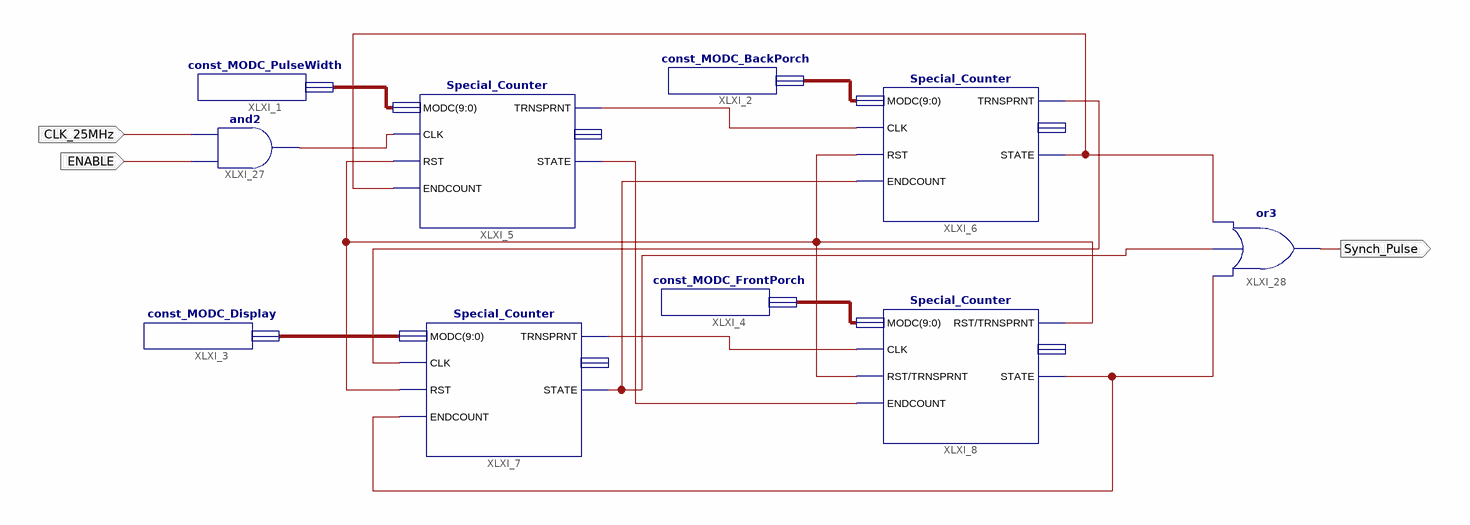
[diagram p0: schematic sheet 1]
// Xilinx ISE schematic H_Synch.sch (spartan6) as structural Verilog: 10 symbols, 3 ports
module H_Synch (
  input  CLK_25MHz,
  input  ENABLE,
  output Synch_Pulse
);

  wire XLXN_2, XLXN_3, XLXN_54, XLXN_81, XLXN_88, XLXN_92, XLXN_93, XLXN_94, XLXN_95;
  wire [9:0] XLXN_8, XLXN_9, XLXN_10, XLXN_11;

  Special_Counter XLXI_6 (
    .CLK(XLXN_2), .RST(XLXN_81), .ENDCOUNT(XLXN_93), .MODC(XLXN_9), .STATE(XLXN_92), .TRNSPRNT(XLXN_88));  // open: Q
  Special_Counter XLXI_7 (
    .CLK(XLXN_88), .RST(XLXN_81), .ENDCOUNT(XLXN_94), .MODC(XLXN_10), .STATE(XLXN_93), .TRNSPRNT(XLXN_3));  // open: Q
  Special_Counter XLXI_8 (
    .CLK(XLXN_3), .RST(XLXN_81), .ENDCOUNT(XLXN_95), .MODC(XLXN_11), .STATE(XLXN_94), .TRNSPRNT(XLXN_81));  // open: Q
  const_MODC_FrontPorch XLXI_4 (.MODC(XLXN_11));
  const_MODC_Display XLXI_3 (.MODC(XLXN_10));
  const_MODC_PulseWidth XLXI_1 (.MODC(XLXN_8));
  const_MODC_BackPorch XLXI_2 (.MODC(XLXN_9));
  and XLXI_27 (XLXN_54, ENABLE, CLK_25MHz);
  or XLXI_28 (Synch_Pulse, XLXN_94, XLXN_93, XLXN_92);
  Special_Counter XLXI_5 (
    .CLK(XLXN_54), .RST(XLXN_81), .ENDCOUNT(XLXN_92), .MODC(XLXN_8), .STATE(XLXN_95), .TRNSPRNT(XLXN_2));  // open: Q
endmodule
